# Altium schematic sheet HF105F-1_005D-1HST1_Updated.schdoc
size 124 x 99 mm; SheetNumber: 10; SheetTotal: 10
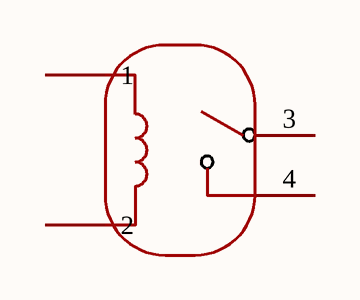
[diagram p0: HF105F-1_005D-1HST1_Updated.schdoc]

## Parts
U?  HF105F-1/005D-1HST  [RELAY-TH_HF105F-XXX-1HXXX-XXX]  (value not drawn)

## Nets

Not connected (* = marked no-connect by the designer): U? 1 2 3 4

## Library data of the parts
U? = HF105F-1/005D-1HST: Manufacturer: HF(宏发); Add into BOM: yes; Coil Voltage: 5V; Contact Form: 1 Set Normally Open: 1A (SPST NO); Contact Rating: 30A@240VAC；20A@28VDC; Switching Voltage(Max): 277V@AC；28V@DC; Coil Rated Power: 900mW; Switching Current(Max): 40A; Coil Type: Non-Polarized - Single Coil; Coil Resistance: 27Ω; Contact Resistance: 50mΩ; Operate Time: 15ms; Release Time: 10ms; Symbol: HF105F-1/005D-1HST; Device: HF105F-1/005D-1HST; LCSC Part Name: 小型大功率5V继电器 单刀单掷-常开; Supplier Part: C2976768; Manufacturer Part: HF105F-1/005D-1HST; Supplier Footprint: 插件,32.3x27.1mm; JLCPCB Part Class: Extended Part; Datasheet: https://item.szlcsc.com/datasheet/HF105F-1%252F005D-1HST/3384988.html; Supplier: LCSC; Convert to PCB: yes; Number of Pins: 4; Contact Material: AgSnO2; Operating Temperature: -55℃~+85℃